# EAGLE board micropet_v2 (EAGLE 6.4), part 1 of 3
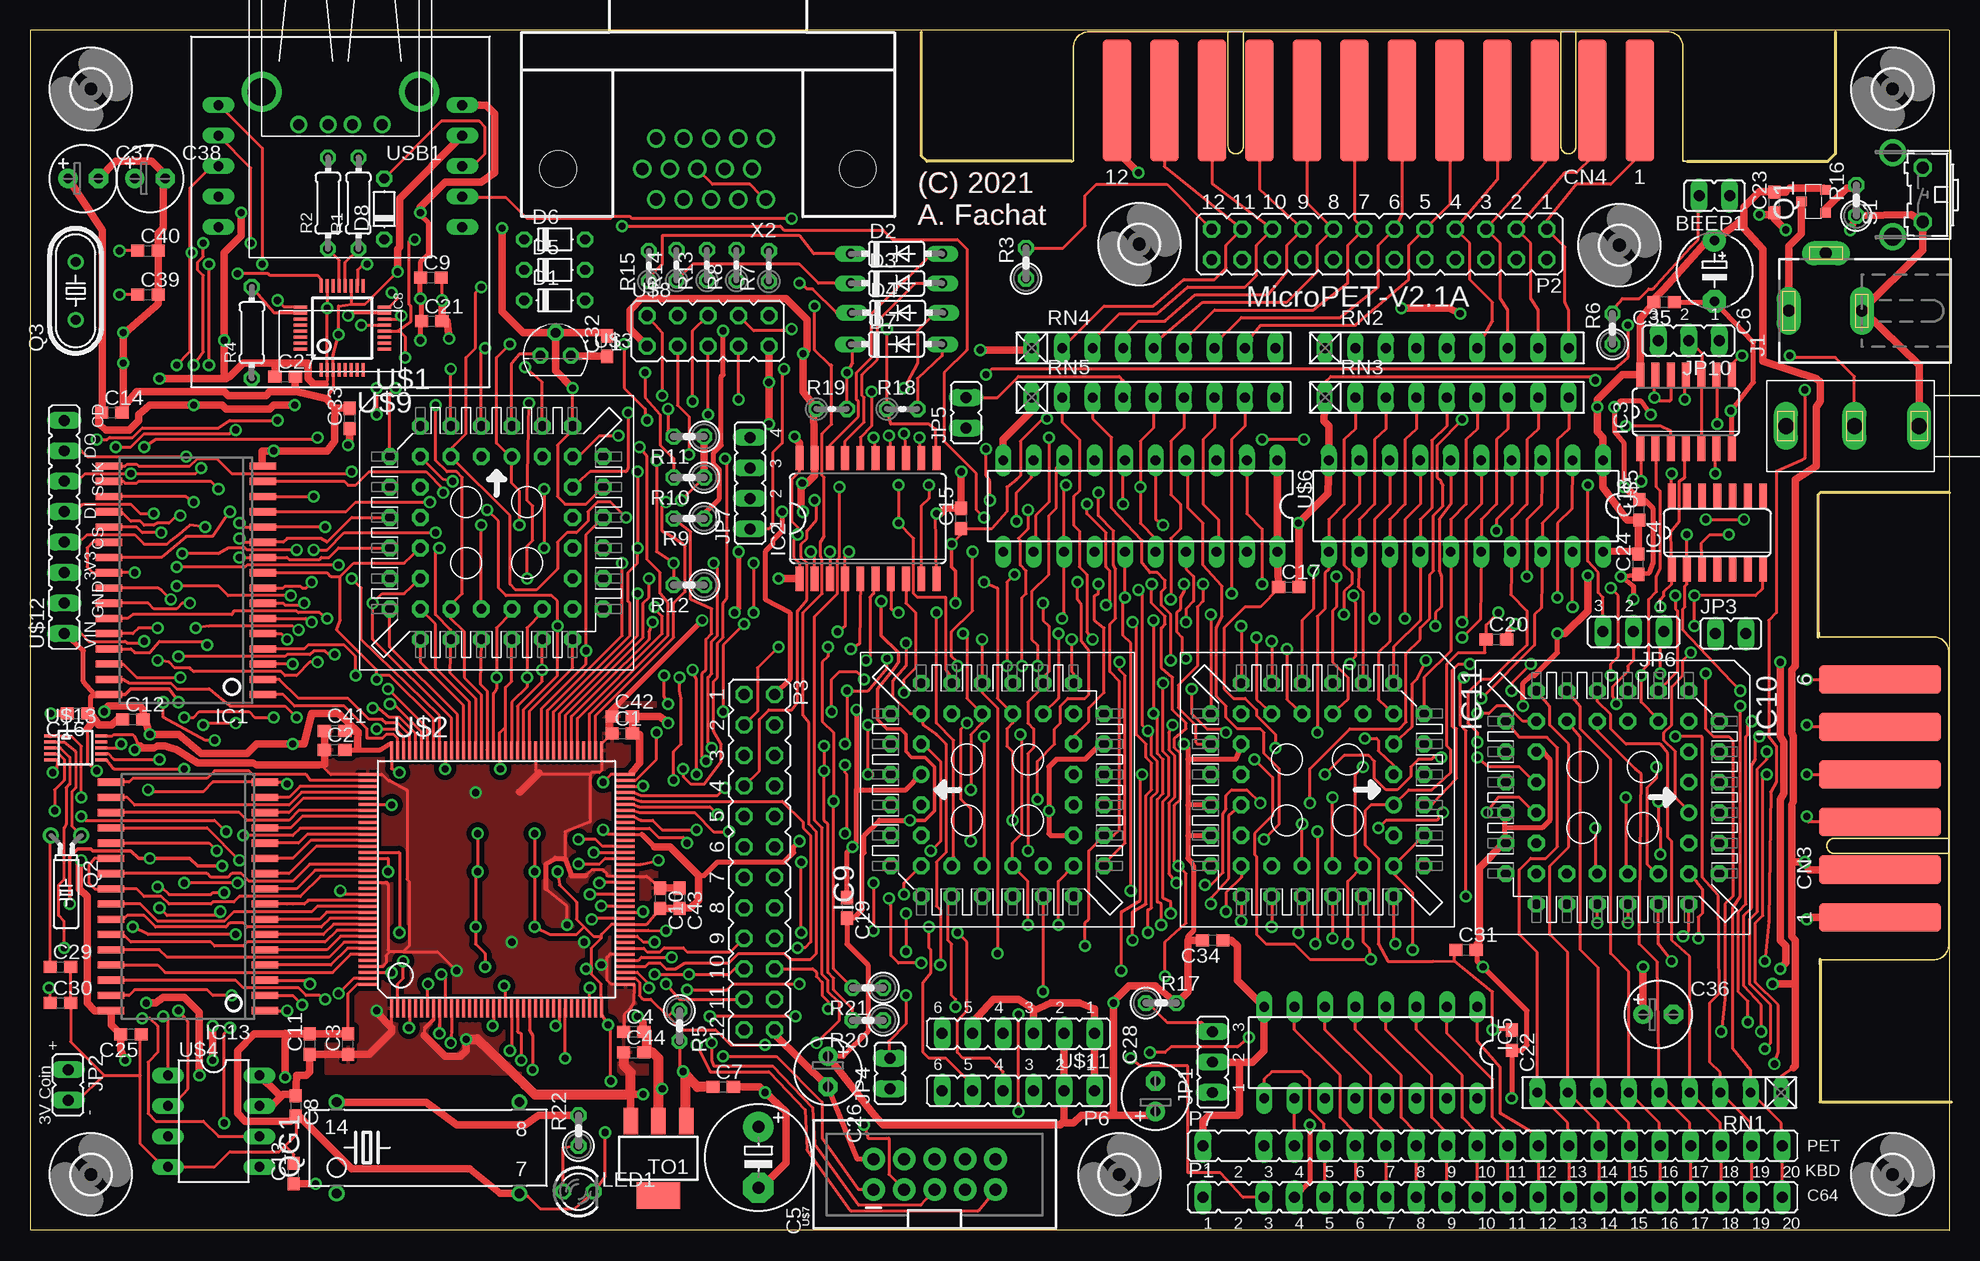
[diagram p6: board, top side]
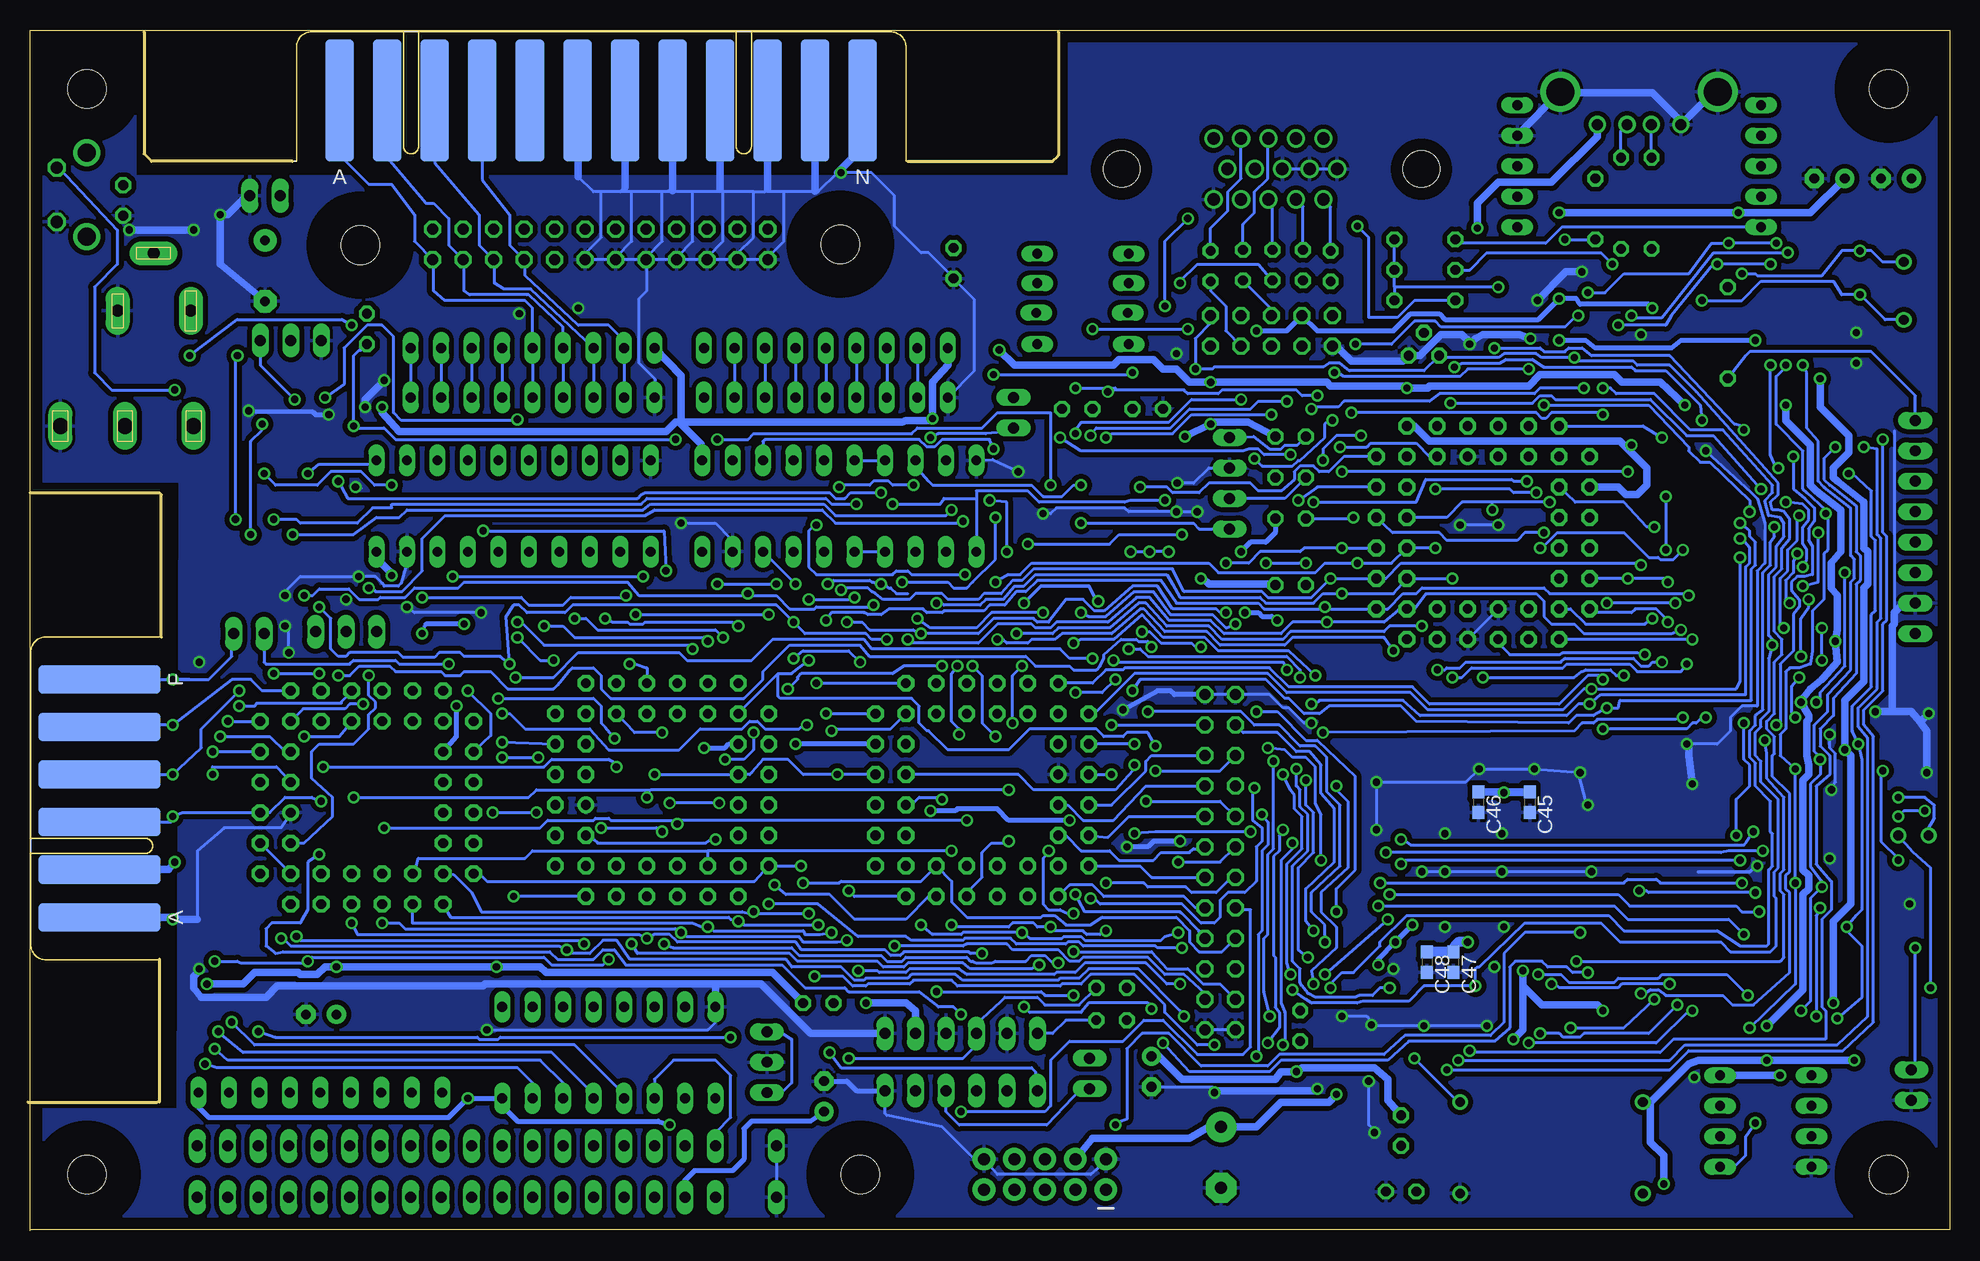
[diagram p7: board, bottom side, seen from below]

Size 160 x 100.09 mm. Coordinates in mm from the lower left corner, seen from the top.
Outline: 160,0.09 0,0.09 0,100.09 75,100.09 159.94,100.09
Outline: 160,0 160,100.09
Copper layers (1*16): Top 0.035mm / dielectric 1.5mm / Bottom 0.035mm
Design rules "default *": minimum track width 8mil, minimum drill 0.3mm, track to track 6mil, track to pad 6mil, pad to pad 6mil, via to via 6mil, smd to smd 6mil, copper to edge 40mil, drill to drill 8mil, minimum pad ring 10mil, minimum via ring 8mil, stop-mask expansion 4mil, vias tented up to drill 0mil, thermal gap 10mil
Milling: 11 lines

## Footprints (pad centres in the part's own frame; a part is rotated, then mirrored left to right if it is on the bottom)
JP2 = drill 0.914 long: 1 0,-1.27; 2 0,1.27
C0603 = smd 1.1 x 1: 1 -0.85,0; 2 0.85,0
E5-8,5 = drill 1.016 pad 2.54: + -2.54,0 | drill 1.016 pad 2.54 octagon: - 2.54,0
E5-6 = drill 0.813 pad 1.905: + -2.54,0 | drill 0.813 pad 1.905 octagon: - 2.54,0
E2,5-6 = drill 0.813 pad 1.6: + -1.27,0 | drill 0.813 pad 1.6 octagon: - 1.27,0
MA156_6-2_KEYED = smd 2.388 x 10.16: 1 -9.906,0; 2 -5.944,0; 3 -1.981,0; 4 1.981,0; 5 5.944,0; 6 9.906,0 | smd 2.388 x 10.16 bottom: A -9.906,0; B -5.944,0; C -1.981,0; D 1.981,0; E 5.944,0; F 9.906,0
MA156_12-2_IEEE = smd 2.388 x 10.16: 1 -21.793,0; 2 -17.831,0; 3 -13.868,0; 4 -9.906,0; 5 -5.944,0; 6 -1.981,0; 7 1.981,0; 8 5.944,0; 9 9.906,0; 10 13.868,0; 11 17.831,0; 12 21.793,0 | smd 2.388 x 10.16 bottom: A -21.793,0; B -17.831,0; C -13.868,0; D -9.906,0; E -5.944,0; F -1.981,0; H 1.981,0; J 5.944,0; K 9.906,0; L 13.868,0; M 17.831,0; N 21.793,0
D-5 = drill 0.813 octagon: A 2.54,0; C -2.54,0
DO35-7 = drill 0.813 long: A 3.81,0; C -3.81,0
3,2 = hole 3.2: 0,0
SOP32 = smd 0.6 x 2.2: 1 -8.89,-6.416; 2 -7.62,-6.416; 3 -6.35,-6.416; 4 -5.08,-6.416; 5 -3.81,-6.416; 6 -2.54,-6.416; 7 -1.27,-6.416; 8 0,-6.416; 9 1.27,-6.416; 10 2.54,-6.416; 11 3.81,-6.416; 12 5.08,-6.416; 13 6.35,-6.416; 14 7.62,-6.416; 15 8.89,-6.416; 16 10.16,-6.416; 17 10.16,6.416; 18 8.89,6.416; 19 7.62,6.416; 20 6.35,6.416; 21 5.08,6.416; 22 3.81,6.416; 23 2.54,6.416; 24 1.27,6.416; 25 0,6.416; 26 -1.27,6.416; 27 -2.54,6.416; 28 -3.81,6.416; 29 -5.08,6.416; 30 -6.35,6.416; 31 -7.62,6.416; 32 -8.89,6.416
SO20W = smd 0.66 x 2.032: 1 -5.715,-5.029; 2 -4.445,-5.029; 3 -3.175,-5.029; 4 -1.905,-5.029; 5 -0.635,-5.029; 6 0.635,-5.029; 7 1.905,-5.029; 8 3.175,-5.029; 9 4.445,-5.029; 10 5.715,-5.029; 11 5.715,5.029; 12 4.445,5.029; 13 3.175,5.029; 14 1.905,5.029; 15 0.635,5.029; 16 -0.635,5.029; 17 -1.905,5.029; 18 -3.175,5.029; 19 -4.445,5.029; 20 -5.715,5.029
SO14 = smd 0.66 x 2.032: 1 -3.81,-3.073; 2 -2.54,-3.073; 3 -1.27,-3.073; 4 0,-3.073; 5 1.27,-3.073; 6 2.54,-3.073; 7 3.81,-3.073; 8 3.81,3.073; 9 2.54,3.073; 10 1.27,3.073; 11 0,3.073; 12 -1.27,3.073; 13 -2.54,3.073; 14 -3.81,3.073
DIL16 = drill 0.813 long: 1 -8.89,-3.81; 2 -6.35,-3.81; 3 -3.81,-3.81; 4 -1.27,-3.81; 5 1.27,-3.81; 6 3.81,-3.81; 7 6.35,-3.81; 8 8.89,-3.81; 9 8.89,3.81; 10 6.35,3.81; 11 3.81,3.81; 12 1.27,3.81; 13 -1.27,3.81; 14 -3.81,3.81; 15 -6.35,3.81; 16 -8.89,3.81
TQFP32-5MM = smd 1.143 x 0.254: 1 -3.5,1.75; 2 -3.5,1.25; 3 -3.5,0.75; 4 -3.5,0.25; 5 -3.5,-0.25; 6 -3.5,-0.75; 7 -3.5,-1.25; 8 -3.5,-1.75; 17 3.5,-1.75; 18 3.5,-1.25; 19 3.5,-0.75; 20 3.5,-0.25; 21 3.5,0.25; 22 3.5,0.75; 23 3.5,1.25; 24 3.5,1.75 | smd 0.254 x 1.143: 9 -1.75,-3.5; 10 -1.25,-3.5; 11 -0.75,-3.5; 12 -0.25,-3.5; 13 0.25,-3.5; 14 0.75,-3.5; 15 1.25,-3.5; 16 1.75,-3.5; 25 1.75,3.5; 26 1.25,3.5; 27 0.75,3.5; 28 0.25,3.5; 29 -0.25,3.5; 30 -0.75,3.5; 31 -1.25,3.5; 32 -1.75,3.5
PLCC44 = drill 0.813 pad 1.397: 1 1.27,6.35 | drill 0.813 pad 1.397 octagon: 2 -1.27,8.89; 3 -1.27,6.35; 4 -3.81,8.89; 5 -3.81,6.35; 6 -6.35,8.89; 7 -8.89,6.35; 8 -6.35,6.35; 9 -8.89,3.81; 10 -6.35,3.81; 11 -8.89,1.27; 12 -6.35,1.27; 13 -8.89,-1.27; 14 -6.35,-1.27; 15 -8.89,-3.81; 16 -6.35,-3.81; 17 -8.89,-6.35; 18 -6.35,-8.89; 19 -6.35,-6.35; 20 -3.81,-8.89; 21 -3.81,-6.35; 22 -1.27,-8.89; 23 -1.27,-6.35; 24 1.27,-8.89; 25 1.27,-6.35; 26 3.81,-8.89; 27 3.81,-6.35; 28 6.35,-8.89; 29 8.89,-6.35; 30 6.35,-6.35; 31 8.89,-3.81; 32 6.35,-3.81; 33 8.89,-1.27; 34 6.35,-1.27; 35 8.89,1.27; 36 6.35,1.27; 37 8.89,3.81; 38 6.35,3.81; 39 8.89,6.35; 40 6.35,8.89; 41 6.35,6.35; 42 3.81,8.89; 43 3.81,6.35; 44 1.27,8.89
DCJ0202 = drill 1 pad 2 long: 1 0,3.1; 2 4.8,0; 3 0,-3
JP2' = drill 0.914 long: 1 -2.54,0; 2 0,0; 3 2.54,0
JP1 = drill 0.914 long: 1 0,-1.27; 2 0,1.27
JP4 = drill 0.914 long: 1 -3.81,0; 2 -1.27,0; 3 1.27,0; 4 3.81,0
LED3MM = drill 0.813 octagon: A -1.27,0; K 1.27,0
C64KEYB = drill 0.914 long: 1 0,0; 3 5.08,0; 4 7.62,0; 5 10.16,0; 6 12.7,0; 7 15.24,0; 8 17.78,0; 9 20.32,0; 10 22.86,0; 11 25.4,0; 12 27.94,0; 13 30.48,0; 14 33.02,0; 15 35.56,0; 16 38.1,0; 17 40.64,0; 18 43.18,0; 19 45.72,0; 20 48.26,0
FLAT24 = drill 0.914 octagon: 1 -13.97,-1.27; 2 -11.43,-1.27; 3 -8.89,-1.27; 4 -6.35,-1.27; 5 -3.81,-1.27; 6 -1.27,-1.27; 7 1.27,-1.27; 8 3.81,-1.27; 9 6.35,-1.27; 10 8.89,-1.27; 11 11.43,-1.27; 12 13.97,-1.27; A -13.97,1.27; B -11.43,1.27; C -8.89,1.27; D -6.35,1.27; E -3.81,1.27; F -1.27,1.27; H 1.27,1.27; J 3.81,1.27; K 6.35,1.27; L 8.89,1.27; M 11.43,1.27; N 13.97,1.27
JP6 = drill 0.914 long: 1 -7.62,1.27; 2 -5.08,1.27; 3 -2.54,1.27; 4 0,1.27; 5 2.54,1.27; 6 5.08,1.27
MICRO3 = smd 0.8 x 0.9: 1 -0.95,-1; 2 0.95,-1; 3 0,1
TC26H = drill 0.813: 1 -1.27,0; 2 1.27,0
HC49/S = drill 0.813: 1 -2.413,0; 2 2.413,0
SG51 = drill 0.813: 1 -7.62,-3.81; 7 7.62,-3.81; 8 7.62,3.81; 14 -7.62,3.81
0204/7 = drill 0.813 octagon: 1 -3.81,0; 2 3.81,0
0207/2V = drill 0.813 octagon: 1 -1.27,0; 2 1.27,0
0204V = drill 0.813 octagon: 1 -1.27,0; 2 1.27,0
RN-9 = drill 0.813 long: 1 -10.16,0; 2 -7.62,0; 3 -5.08,0; 4 -2.54,0; 5 0,0; 6 2.54,0; 7 5.08,0; 8 7.62,0; 9 10.16,0
B3F-31XX = drill 1.016 octagon: 1 -2.261,-1.245; 2 2.261,-1.245 | drill 1.499 pad 2.159: 3 -3.505,1.245; 4 3.505,1.245
SOT223 = smd 1.219 x 2.235: 1 -2.311,-3.099; 2 0,-3.099; 3 2.311,-3.099 | smd 3.6 x 2.2: 4 0,3.099
TQFP144 = smd 0.27 x 1.5: 1 -8.75,-12.02; 2 -8.25,-12.02; 3 -7.75,-12.02; 4 -7.25,-12.02; 5 -6.75,-12.02; 6 -6.25,-12.02; 7 -5.75,-12.02; 8 -5.25,-12.02; 9 -4.75,-12.02; 10 -4.25,-12.02; 11 -3.75,-12.02; 12 -3.25,-12.02; 13 -2.75,-12.02; 14 -2.25,-12.02; 15 -1.75,-12.02; 16 -1.25,-12.02; 17 -0.75,-12.02; 18 -0.25,-12.02; 19 0.25,-12.02; 20 0.75,-12.02; 21 1.25,-12.02; 22 1.75,-12.02; 23 2.25,-12.02; 24 2.75,-12.02; 25 3.25,-12.02; 26 3.75,-12.02; 27 4.25,-12.02; 28 4.75,-12.02; 29 5.25,-12.02; 30 5.75,-12.02; 31 6.25,-12.02; 32 6.75,-12.02; 33 7.25,-12.02; 34 7.75,-12.02; 35 8.25,-12.02; 36 8.75,-12.02; 73 8.75,9.48; 74 8.25,9.48; 75 7.75,9.48; 76 7.25,9.48; 77 6.75,9.48; 78 6.25,9.48; 79 5.75,9.48; 80 5.25,9.48; 81 4.75,9.48; 82 4.25,9.48; 83 3.75,9.48; 84 3.25,9.48; 85 2.75,9.48; 86 2.25,9.48; 87 1.75,9.48; 88 1.25,9.48; 89 0.75,9.48; 90 0.25,9.48; 91 -0.25,9.48; 92 -0.75,9.48; 93 -1.25,9.48; 94 -1.75,9.48; 95 -2.25,9.48; 96 -2.75,9.48; 97 -3.25,9.48; 98 -3.75,9.48; 99 -4.25,9.48; 100 -4.75,9.48; 101 -5.25,9.48; 102 -5.75,9.48; 103 -6.25,9.48; 104 -6.75,9.48; 105 -7.25,9.48; 106 -7.75,9.48; 107 -8.25,9.48; 108 -8.75,9.48 | smd 1.5 x 0.27: 37 10.75,-10.02; 38 10.75,-9.52; 39 10.75,-9.02; 40 10.75,-8.52; 41 10.75,-8.02; 42 10.75,-7.52; 43 10.75,-7.02; 44 10.75,-6.52; 45 10.75,-6.02; 46 10.75,-5.52; 47 10.75,-5.02; 48 10.75,-4.52; 49 10.75,-4.02; 50 10.75,-3.52; 51 10.75,-3.02; 52 10.75,-2.52; 53 10.75,-2.02; 54 10.75,-1.52; 55 10.75,-1.02; 56 10.75,-0.52; 57 10.75,-0.02; 58 10.75,0.48; 59 10.75,0.98; 60 10.75,1.48; 61 10.75,1.98; 62 10.75,2.48; 63 10.75,2.98; 64 10.75,3.48; 65 10.75,3.98; 66 10.75,4.48; 67 10.75,4.98; 68 10.75,5.48; 69 10.75,5.98; 70 10.75,6.48; 71 10.75,6.98; 72 10.75,7.48; 109 -10.75,7.48; 110 -10.75,6.98; 111 -10.75,6.48; 112 -10.75,5.98; 113 -10.75,5.48; 114 -10.75,4.98; 115 -10.75,4.48; 116 -10.75,3.98; 117 -10.75,3.48; 118 -10.75,2.98; 119 -10.75,2.48; 120 -10.75,1.98; 121 -10.75,1.48; 122 -10.75,0.98; 123 -10.75,0.48; 124 -10.75,-0.02; 125 -10.75,-0.52; 126 -10.75,-1.02; 127 -10.75,-1.52; 128 -10.75,-2.02; 129 -10.75,-2.52; 130 -10.75,-3.02; 131 -10.75,-3.52; 132 -10.75,-4.02; 133 -10.75,-4.52; 134 -10.75,-5.02; 135 -10.75,-5.52; 136 -10.75,-6.02; 137 -10.75,-6.52; 138 -10.75,-7.02; 139 -10.75,-7.52; 140 -10.75,-8.02; 141 -10.75,-8.52; 142 -10.75,-9.02; 143 -10.75,-9.52; 144 -10.75,-10.02
TO92 = drill 0.813 octagon: 1 -1.27,1.27; 2 0,3.175; 3 1.27,1.27
DIL08 = drill 0.813 long: 1 -11.43,-2.54; 2 -8.89,-2.54; 3 -6.35,-2.54; 4 -3.81,-2.54; 5 -3.81,5.08; 6 -6.35,5.08; 7 -8.89,5.08; 8 -11.43,5.08
DIL20 = drill 0.813 long: 1 -10.16,-3.81; 2 -7.62,-3.81; 3 -5.08,-3.81; 4 -2.54,-3.81; 5 0,-3.81; 6 2.54,-3.81; 7 5.08,-3.81; 8 7.62,-3.81; 9 10.16,-3.81; 10 12.7,-3.81; 11 12.7,3.81; 12 10.16,3.81; 13 7.62,3.81; 14 5.08,3.81; 15 2.54,3.81; 16 0,3.81; 17 -2.54,3.81; 18 -5.08,3.81; 19 -7.62,3.81; 20 -10.16,3.81
FLAT10BOX = drill 1.016 pad 1.88: 1 -1.27,5.08; 2 1.27,5.08; 3 -1.27,2.54; 4 1.27,2.54; 5 -1.27,0; 6 1.27,0; 7 -1.27,-2.54; 8 1.27,-2.54; 9 -1.27,-5.08; 10 1.27,-5.08
FLAT10RIB = drill 0.914 octagon: 1 -5.08,-1.27; 2 -5.08,1.27; 3 -2.54,-1.27; 4 -2.54,1.27; 5 0,-1.27; 6 0,1.27; 7 2.54,-1.27; 8 2.54,1.27; 9 5.08,-1.27; 10 5.08,1.27
ETHOLIENC = drill 0.813 long: 1_1 15.24,10.16; 1_2 12.7,10.16; 1_3 10.16,10.16; 1_4 7.62,10.16; 1_5 5.08,10.16; 2_1 5.08,-10.16; 2_2 7.62,-10.16; 2_3 10.16,-10.16; 2_4 12.7,-10.16; 2_5 15.24,-10.16
CUI_MJ-3502-B = drill 1.3 pad 2 long: 1 -5.084,0; 2 0.313,0; 3 6.028,0
GRAVITECH-SDCARD = drill 0.914 long: 3V3 -3.81,0; CD 8.89,0; CS -1.27,0; DI 1.27,0; DO 6.35,0; GND -6.35,0; SCK 3.81,0; VIN -8.89,0
MSOP10 = smd 0.25 x 1: 1 -1,-2.113; 2 -0.5,-2.113; 3 0,-2.113; 4 0.5,-2.113; 5 1,-2.113; 6 1,2.113; 7 0.5,2.113; 8 0,2.113; 9 -0.5,2.113; 10 -1,2.113
USB-A-H = drill 0.914: D+ 2.718,-1.003; D- 2.718,1.003; GND 2.718,-3.493; VBUS 2.718,3.493 | drill 2.311: GND@1 0,6.566; GND@2 0,-6.566
HDR15RA = drill 1.016: 1 4.318,2.54; 2 2.032,2.54; 3 -0.254,2.54; 4 -2.54,2.54; 5 -4.826,2.54; 6 5.461,0; 7 3.175,0; 8 0.889,0; 9 -1.397,0; 10 -3.683,0; 11 4.318,-2.54; 12 2.032,-2.54; 13 -0.254,-2.54; 14 -2.54,-2.54; 15 -4.826,-2.54 | hole 3.048: -12.497,0; 12.497,0

## Placement (x,y rotation side)
BEEP1  PIEZOBEEPER  [JP2]  140.41,86.28 90 top
C1  0.1u  [C0603]  49.37,41.43 0 top
C2  0.1u  [C0603]  25.39,40.08 0 top
C3  0.1u  [C0603]  26.51,15.56 90 top
C4  0.1u  [C0603]  50.32,16.59 0 top
C5  47u  [E5-8,5]  60.72,6.11 270 top
C6  47u  [E5-6]  140.41,80.01 270 top
C7  100n  [C0603]  57.78,11.99 0 top
C8  100n  [C0603]  22.14,10.4 270 top
C9  1.0u Cer  [C0603]  33.41,79.45 0 top
C10  1u  [C0603]  52.54,27.7 270 top
C11  1u  [C0603]  23.33,15.56 90 top
C12  0.1u  [C0603]  8.57,42.62 0 top
C13  0.1u  [C0603]  21.98,4.76 90 top
C14  0.1u  [C0603]  6.82,68.18 0 top
C15  0.1u  [C0603]  77.62,59.37 90 top
C16  0.1u  [C0603]  3.96,43.1 180 top
C17  0.1u  [C0603]  104.93,53.66 0 top
C18  0.1u  [C0603]  134.14,60.09 90 top
C19  0.1u  [C0603]  68.1,26.91 270 top
C20  0.1u  [C0603]  122.23,49.29 0 top
C21  0.1u  [C0603]  33.49,75.8 0 top
C22  0.1u  [C0603]  123.5,15.88 270 top
C23  0.1u  [C0603]  145.41,85.73 90 top
C24  0.1u  [C0603]  134.06,55.56 90 top
C25  0.1u  [C0603]  8.41,16.35 180 top
C26  47u  [E2,5-6]  66.51,13.26 270 top
C27  0.1u  [C0603]  21.27,71.2 0 top
C28  22u  [E2,5-6]  93.82,11.19 90 top
C29  18p  [C0603]  2.54,21.99 0 top
C30  18p  [C0603]  2.54,18.97 0 top
C31  0.1u  [C0603]  119.69,23.42 0 top
C32  0.1u  [C0603]  48.1,73.74 90 top
C33  0.1u  [C0603]  26.66,67.71 90 top
C34  0.1u  [C0603]  98.58,24.21 180 top
C35  0.1u  [C0603]  136.2,77.39 180 top
C36  22u  [E2,5-6]  135.73,18.02 0 top
C37  22u  [E2,5-6]  4.44,87.71 0 top
C38  22u  [E2,5-6]  10,87.71 0 top
C39  18p  [C0603]  9.84,78.03 0 top
C40  18p  [C0603]  9.84,81.68 0 top
C41  0.1u  [C0603]  25.39,41.67 0 top
C42  0.1u  [C0603]  49.37,42.86 0 top
C43  0.1u  [C0603]  54.13,27.7 270 top
C44  0.1u  [C0603]  50.32,14.84 0 top
C45  0.1u  [C0603]  35,35.72 270 bottom
C46  0.1u  [C0603]  39.29,35.72 270 bottom
C47  0.1u  [C0603]  41.35,22.38 270 bottom
C48  0.1u  [C0603]  43.57,22.38 270 bottom
CN3  PORT_CASSETTE_EDGE  [MA156_6-2_KEYED]  154.22,36.04 90 top
CN4  PORT_IEEE_EDGE  [MA156_12-2_IEEE]  112.39,94.22 180 top
D1  1N4148  [D-5]  43.73,77.55 0 top
D2  1N4148DO35-7  [DO35-7]  72.23,81.44 0 top
D3  1N4148DO35-7  [DO35-7]  72.23,78.98 0 top
D4  1N4148DO35-7  [DO35-7]  72.31,76.52 0 top
D5  1N4148  [D-5]  43.73,80.09 0 top
D6  1N4148  [D-5]  43.73,82.63 0 top
D7  1N4148DO35-7  [DO35-7]  72.23,73.9 0 top
D8  1N4148  [D-5]  29.52,85.17 90 top
H1  MOUNT-HOLE3.2  [3,2]  5.08,4.68 0 top
H2  MOUNT-HOLE3.2  [3,2]  5.08,95.17 0 top
H3  MOUNT-HOLE3.2  [3,2]  155.25,95.17 0 top
H4  MOUNT-HOLE3.2  [3,2]  155.25,4.68 0 top
H5  MOUNT-HOLE3.2  [3,2]  92.47,82.23 0 top
H6  MOUNT-HOLE3.2  [3,2]  132.47,82.15 0 top
H7  MOUNT-HOLE3.2  [3,2]  90.8,4.68 0 top
IC1  RAMSOCK32TO512KSOP  [SOP32]  13.01,53.58 90 top
IC2  74LS245DW  [SO20W]  69.84,59.37 0 top
IC3  74HCT00D  [SO14]  138.03,68.26 0 top
IC4  74LS86D  [SO14]  140.65,58.18 0 top
IC5  74LS145N  [DIL16]  111.75,14.84 180 top
IC8  MAX3421E  [TQFP32-5MM]  26.03,75.25 90 top
IC9  VIAPLCC  [PLCC44]  80.64,36.75 90 top
IC10  PIAPLCC  [PLCC44]  131.92,36.12 270 top
IC11  PIAPLCC  [PLCC44]  107.31,36.75 270 top
IC13  RAMSOCK32TO512KSOP  [SOP32]  13.17,27.23 90 top
J1  DCJ0202  [DCJ0202]  149.7,76.68 90 top
JP1  [JP2']  98.58,14.05 90 top
JP2  [JP1]  3.17,12.14 180 top
JP3  [JP1]  141.76,49.77 270 top
JP4  [JP1]  71.67,13.1 0 top
JP5  [JP1]  78.02,68.18 0 top
JP6  [JP2']  133.66,49.93 180 top
JP7  [JP4]  60,62.31 90 top
JP10  [JP2']  138.27,74.22 180 top
LED1  [LED3MM]  45.72,3.25 0 top
P1  C64KEYB  [C64KEYB]  97.78,2.78 0 top
P2  IEEE488FLATCABLE  [FLAT24]  112.47,82.23 180 top
P3  PETUSERPORT  [FLAT24]  60.8,30.72 270 top
P6  CBMTAPE  [JP6]  81.12,12.94 180 top
P7  PETKEYBD  [C64KEYB]  97.78,7.06 0 top
Q1  IRLML5203  [MICRO3]  148.66,85.8 90 top
Q2  32kHz  [TC26H]  3.01,32.94 180 top
Q3  12MHz  [HC49/S]  3.8,78.34 90 top
QG1  50MHz  [SG51]  33.17,6.91 0 top
R1  33  [0204/7]  27.38,85.65 90 top
R2  33  [0204/7]  24.84,85.65 90 top
R3  2k4  [0207/2V]  83.02,80.65 90 top
R4  33  [0204/7]  18.49,74.85 90 top
R5  1k  [0207/2V]  54.13,17.07 270 top
R6  10  [0207/2V]  131.92,75.17 90 top
R7  68  [0204V]  61.59,80.41 90 top
R8  68  [0204V]  58.89,80.49 90 top
R9  10k  [0207/2V]  54.92,59.37 180 top
R10  10k  [0207/2V]  54.92,62.79 180 top
R11  10k  [0207/2V]  54.92,66.2 180 top
R12  1k  [0207/2V]  54.92,53.82 180 top
R13  390  [0204V]  56.43,80.49 90 top
R14  390  [0204V]  53.89,80.49 90 top
R15  390  [0204V]  51.59,80.41 90 top
R16  100k  [0207/2V]  152.24,85.88 90 top
R17  390  [0207/2V]  94.29,18.97 0 top
R18  2320  [0204V]  72.7,68.5 0 top
R19  680  [0204V]  66.83,68.5 0 top
R20  10  [0207/2V]  69.84,17.54 180 top
R21  10  [0207/2V]  69.84,20.24 180 top
R22  390  [0207/2V]  45.72,8.33 90 top
RN1  10k  [RN-9]  135.81,11.51 180 top
RN2  2k4  [RN-9]  118.1,73.58 0 top
RN3  5k1  [RN-9]  118.1,69.45 0 top
RN4  2k4  [RN-9]  93.66,73.58 0 top
RN5  5k1  [RN-9]  93.66,69.45 0 top
S1  [B3F-31XX]  156.52,86.36 90 top
TO1  LM2937SOT-3.3V  [SOT223]  52.38,6.03 180 top
U$1  W65C816SPLCC  [PLCC44]  38.89,58.18 0 top
U$2  XC95288XLTQ144  [TQFP144]  38.89,30.56 0 top
U$3  DS1813  [TO92]  43.81,71.68 0 top
U$4  SPIFLASH  [DIL08]  14.04,1.51 270 top
U$5  74LS641  [DIL20]  120.96,60.4 180 top
U$6  74LS641  [DIL20]  93.82,60.4 180 top
U$7  XILINXPROG  [FLAT10BOX]  75.4,4.68 90 top
U$8  MONOVIDAUDIO  [FLAT10RIB]  56.51,75.01 0 top
U$9  ETHOLIENC  [ETHOLIENC]  25.87,78.58 90 top
U$10  MONOAUDIOB  [CUI_MJ-3502-B]  152.39,67.07 180 top
U$11  PETSKEY_EXTRA  [JP6]  81.12,17.7 180 top
U$12  SD-CARD-GRAVI  [GRAVITECH-SDCARD]  2.85,58.66 90 top
U$13  MCP79510  [MSOP10]  3.8,40.24 270 top
USB1  USB-A-H  [USB-A-H]  25.87,94.93 270 top
X2  D-SUB15-HDR15RA  [HDR15RA]  56.51,88.5 180 top

## Tracks (layer width: path | path; a pad name or v marks a point on that pad's centre or on a via)
12MHZ  (via drill 0.6)
  Top 0.254: IC8.24 24.28,79.3 23.97,79.61 20,79.61 19.84,79.77 v17.3,79.77 | C40.1 v7.46,81.68
  Bottom 0.254: v17.3,79.77 16.19,79.77 16.03,79.61 10.63,79.61 C40.1 v7.46,81.68 6.5,81.68 5.58,80.76 Q3.2
50M  (via drill 0.6)
  Top 0.254: v44.6,14.37 44.6,18.5 U$2.30
  Bottom 0.254: v44.6,14.37 41.05,10.81 40.86,10.81 40.86,10.78 QG1.8
/C1MTR  (via drill 0.6)
  Top 0.254: v125.09,47.23 123.5,45.64 v123.5,45.01
  Bottom 0.254: JP3.1 140.49,47.39 140.33,47.23 133.34,47.23 133.03,47.55 129.53,47.55 129.22,47.23 v125.09,47.23 | v123.5,45.01 121.6,43.1 121.6,41.27 IC10.20
/C2MTR  (via drill 0.6)
  Top 0.254: IC9.15 v84.45,19.92 | v73.02,19.61 73.02,17.22 71.59,15.8 71.59,14.45 JP4.2 | IC3.12 136.76,69.21 136.68,69.14 135.57,69.14 135.41,69.29 | 135.41,69.29 v135.41,69.45 | v135.41,69.45 135.41,71.26 IC3.13 | v97.94,28.81 98.42,28.81 99.45,29.84 99.45,34.77 99.69,35.16 99.69,36.27 100.17,36.75 101.44,36.75 v102.55,35.64 | v106.67,35.64 106.67,38.5 110.01,41.83 114.14,41.83 114.69,42.39 114.69,48.1 115.88,49.29 115.88,50.24 116.68,51.04 116.68,54.69 116.99,55.01 116.99,59.61 117.79,60.4 117.79,62.15 117.63,62.31 117.63,62.47 117.31,62.79 117.31,65.48 v119.38,67.63 | v135.41,69.45 135.73,69.45 135.41,69.29
  Bottom 0.254: v84.45,19.92 75.72,19.92 75.4,19.61 v73.02,19.61 | IC9.15 85.08,27.86 86.99,25.96 91.28,25.96 93.34,28.02 96.99,28.02 v97.94,28.81 | v102.55,35.64 v106.67,35.64 | v119.38,67.63 119.69,67.63 119.77,67.55 129.06,67.55 129.69,68.18 129.69,74.53 130.65,75.49 131.92,75.49 133.82,73.58 133.82,70.56 v135.41,69.45
/FRAMSEL  (via drill 0.6)
  Top 0.254: IC1.22 5.23,57.39 4.76,56.91 4.76,55.32 5.23,54.85 IC1.24 v8.73,54.85 | U$2.2 30.63,20.56 30.95,20.87 30.96,20.87 31.11,21.03 v31.11,22.46 | v15.39,40.88 14.6,40.88 11.11,42.78 v11.11,44.05
  Bottom 0.254: v31.11,22.46 14.12,22.46 13.81,22.78 13.81,28.02 14.12,28.34 14.12,29.77 13.81,30.08 13.81,36.12 15.24,37.7 15.24,39.77 v15.39,40.88 | v11.11,44.05 10.79,44.37 10.79,44.85 8.73,47.07 v8.73,54.85
/IRQ  (via drill 0.6)
  Top 0.254: IC10.41 138.9,29.13 | 138.9,29.13 139.38,28.5 139.38,26.43 139.06,26.11 v139.06,24.37 | IC11.42 IC11.41 113.66,29.77 115.25,28.18 v115.25,23.42 | 138.9,29.13 138.11,29.84 | v63.81,17.86 v56.67,17.86 | v56.35,39.13 56.03,39.45 56.03,46.43 56.35,46.75 56.35,49.29 56.83,49.77 56.83,51.83 55.08,52.63 55.08,58.26 R9.2 | v37.62,78.66 37.14,78.18 37.14,73.58 36.35,72.79 36.35,66.44 35.08,65.17 U$1.5 40,59.61 40,53.9 40.48,53.42 42.22,53.42 43.97,55.17 43.97,57.39 44.76,58.18 45.56,58.18 46.51,59.13 46.51,59.93 47.3,60.72 48.41,60.72 v49.68,59.45
  Bottom 0.254: v139.06,24.37 138.9,24.37 138.27,23.73 115.88,23.73 v115.25,23.42 115.25,23.1 113.34,23.1 112.23,24.21 111.12,24.21 110.01,22.62 96.99,22.62 96.52,21.99 92.39,21.99 91.28,20.88 90.48,20.88 90.32,21.03 86.83,21.03 86.51,21.35 82.86,21.35 82.23,20.88 74.29,20.88 74.13,21.03 72.54,21.03 71.75,21.83 67.62,21.83 64.13,18.34 v63.81,17.86 | IC10.42 IC10.41 | v56.67,17.86 56.67,18.02 57.15,19.92 57.15,24.37 56.83,24.69 56.83,31.35 56.35,31.83 v56.35,39.13 | D6.A D5.A 46.27,78.66 | 46.27,78.66 D1.A | v37.62,78.66 46.27,78.66 | R9.2 49.76,59.37 v49.68,59.45
/NMI  (via drill 0.6)
  Top 0.254: U$1.7 30,69.77 v30.47,70.25 | v53.18,68.5 53.18,66.67 R11.2
  Bottom 0.254: JP7.4 58.02,66.2 56.67,65.17 55.72,65.17 55.4,65.48 54.37,65.48 R11.2 | v30.47,70.25 34.13,70.25 34.6,69.77 42.54,69.77 43.33,69.14 50.48,69.14 50.95,68.66 53.02,68.66 v53.18,68.5
/RAMCS
  Top 0.254: IC13.22 5.39,31.04 4.92,30.4 4.92,28.97 5.39,28.5 IC13.24 6.91,28.65 7.3,28.65 7.46,28.5 8.89,28.5 9.52,27.86 10.95,27.86 11.58,27.23 15.08,27.23 15.24,27.38 16.98,27.38 17.46,27.86 22.54,27.86 24.22,29.54 U$2.126
/RAMWE
  Top 0.254: IC13.29 10.63,22.15 11.27,21.51 25.24,21.51 26.72,23.04 U$2.139
/RES  (via drill 0.6)
  Top 0.254: IC11.37 111.12,24.05 111.6,23.57 v111.75,22.62 106.67,22.62 105.41,23.89 103.02,23.89 102.23,24.69 102.23,31.19 102.07,31.35 102.07,33.1 103.58,34.61 103.58,37.78 v102.07,39.29 | v147.95,70.09 147.95,64.37 147.63,64.21 145.57,63.26 145.57,51.51 144.93,50.88 144.93,41.2 145.57,40.4 145.57,37.39 145.09,36.59 144.93,25.8 v144.62,22.46 | v72.38,62.15 v72.38,58.98 73.66,57.71 73.66,53.1 73.97,52.78 76.35,52.78 76.35,46.75 76.83,46.12 IC9.37 | U$6.8 85.56,63.58 85.56,60.25 84.93,59.61 84.93,54.69 83.5,53.26 83.5,49.29 83.97,48.82 v83.97,47.07 | U$1.44 40.16,72.31 40.79,73.1 42.46,73.1 U$3.1 | v62.86,71.83 62.86,71.68 62.7,71.52 62.7,65.64 61.91,64.85 61.91,58.82 61.59,58.5 JP7.1 | U$2.143 26.99,21.04 v25.71,19.76 | IC8.12 30.63,75 | 30.63,75 30.8,75 31.27,74.53 v31.27,72.79 | 30.63,75 31.74,75.79 31.74,77.07 31.59,77.23 31.59,82.47 v32.06,82.63 | v96.83,45.16 96.83,43.1 98.1,41.83 99.37,41.83 v99.69,41.51 | v136.84,22.46 135.73,23.89 IC10.37
  Bottom 0.254: v111.75,22.62 112.23,22.15 116.52,22.15 117.15,22.78 136.52,22.78 v136.84,22.46 137.16,22.46 137.31,22.3 142.39,22.3 142.71,22.46 v144.62,22.46 | S1.2 157.59,88.62 152.71,83.42 152.71,80.57 154.62,78.66 154.62,71.52 153.19,70.09 v147.95,70.09 | U$6.8 86.2,63.74 85.08,62.47 84.77,62.15 76.51,62.15 75.56,61.2 73.97,61.2 73.02,62.15 v72.38,62.15 | v72.38,58.98 63.02,58.98 62.54,58.5 JP7.1 | v25.71,19.76 25.39,19.76 24.92,20.08 24.28,20.08 23.65,19.61 18.89,19.61 18.09,18.81 16.35,18.81 13.33,21.51 13.33,28.18 13.65,28.5 13.65,29.61 13.33,29.92 13.33,36.43 14.76,37.86 14.76,39.61 14.6,39.77 14.6,41.2 15.24,41.83 15.24,42.47 14.6,43.1 14.6,47.39 13.97,48.02 13.97,49.29 14.6,49.93 14.6,54.53 13.97,55.17 13.97,56.91 13.33,57.71 13.33,59.29 13.81,59.93 14.28,60.09 14.76,60.09 14.92,60.72 14.28,61.36 14.28,62.31 21.11,69.93 23.33,72.15 26.03,72.15 26.35,72.47 30.95,72.47 v31.27,72.79 33.97,72.79 34.44,73.1 37.14,73.1 37.62,72.79 42.38,72.79 U$3.1 43.81,71.68 50,71.68 50.8,72.31 51.75,72.31 52.22,71.99 61.27,71.99 61.43,71.83 v62.86,71.83 62.86,74.37 61.59,75.64 U$8.10 | v83.97,47.07 87.15,47.07 88.1,46.43 95.72,46.43 96.04,46.12 96.04,45.96 v96.83,45.16 | v99.69,41.51 99.69,40.08 100.48,39.29 v102.07,39.29 | v32.06,82.63 D8.C
/SEL1  (via drill 0.6)
  Top 0.254: IC10.25 125.41,34.85 124.14,36.12 122.39,36.12 v121.44,34.85 | v117.79,34.85 117.31,34.21 113.02,34.21 v112.39,33.58 | U$2.69 50.37,36.54 50.95,36.27 57.3,36.27 v57.94,36.91 | v107.31,33.26 107.31,24.21 v107.15,23.89 | v74.29,22.3 72.38,22.3 71.75,22.94 71.75,27.07 v71.59,27.7
  Bottom 0.254: v121.44,34.85 v117.79,34.85 | v112.39,33.58 107.79,33.58 v107.31,33.26 | v57.94,36.91 58.1,36.59 58.1,34.21 57.3,33.58 57.3,32.46 57.78,31.99 57.78,29.13 58.73,28.18 60.16,28.18 60.8,27.54 60.8,26.11 61.27,25.64 62.38,25.64 63.97,27.23 70.8,27.23 71.11,27.54 v71.59,27.7 | v107.15,23.89 106.36,23.57 96.52,23.57 95.88,22.94 89.05,22.94 88.58,22.46 87.31,22.46 86.99,22.78 81.91,22.78 81.59,22.46 81.43,22.46 81.12,22.3 79.85,22.3 79.53,22.46 76.99,22.46 76.51,22.94 75.4,22.94 74.77,22.3 v74.29,22.3
/SEL2  (via drill 0.6)
  Top 0.254: U$2.68 50.24,36.04 50.95,35.8 62.7,35.8 64.45,34.05 64.45,33.58 65.08,32.94 65.08,24.05 64.61,23.57 v63.97,23.57 | v98.42,27.23 98.42,27.7 99.93,29.37 99.93,34.61 IC11.25
  Bottom 0.254: v63.97,23.57 66.03,23.57 66.19,23.73 72.23,23.73 72.54,24.05 73.5,24.05 73.66,23.89 77.78,23.89 78.26,24.37 82.07,24.37 82.23,24.21 86.51,24.21 86.99,24.53 90.96,24.53 94.29,27.23 v98.42,27.23
/SEL4  (via drill 0.6)
  Top 0.254: U$2.66 50.28,35.04 50.8,34.85 55.4,34.85 56.99,33.26 v58.26,33.26 | v67.94,33.1 67.94,33.26 68.1,33.42 68.1,38.02 67.94,38.18 v67.94,38.81
  Bottom 0.254: v58.26,33.26 66.19,33.26 v67.94,33.1 | v67.94,38.81 68.1,38.34 69.53,36.75 76.35,36.75 77.62,38.02 IC9.25
/SRQIN  (via drill 0.6)
  Top 0.254: CN4.10 98.52,87.29 P2.10 102.23,82.15 102.23,79.61 101.28,78.66 96.52,78.66 93.97,76.44 90.8,76.44 88.58,74.22 RN4.3 | RN5.3 88.58,67.71 90.16,66.12 90.16,60.25 92.7,57.55 92.7,55.64 93.34,54.85 93.97,54.85 94.61,54.21 94.61,53.58 94.29,53.26 94.29,52.15 95.09,51.36 v95.09,47.55 | R20.2 68.57,18.49 66.99,20.08 66.99,21.03 66.51,21.51 66.51,33.89 66.19,34.21 v66.19,38.34 v66.19,40.4
  Bottom 0.254: RN4.3 RN5.3 | 97.63,46.43 IC11.19 | v66.19,38.34 60.8,38.34 P3.3 | v66.19,40.4 66.83,41.51 68.57,41.51 68.89,41.2 70.48,41.2 71.11,41.83 76.67,41.83 78.42,40.08 83.5,40.08 85.08,41.67 85.24,41.67 85.88,42.31 85.88,43.74 86.51,44.37 97.47,44.37 97.63,44.53 97.63,46.43 | 97.63,46.43 96.52,46.43 v95.09,47.55
/USBINT  (via drill 0.6)
  Top 0.254: v28.09,80.57 27.78,80.57 27.3,80.09 27.3,78.77 IC8.18
  Bottom 0.254: D5.C 40,80.09 38.57,81.52 29.05,81.52 v28.09,80.57
A0  (via drill 0.6)
  Top 0.254: IC11.39 113.66,24.21 v113.82,23.89 | U$2.104 32.14,41.44 30.79,42.78 30,42.78 29.13,43.49 29.12,43.49 v28.57,43.58 | v24.6,58.66 IC1.12 17.93,58.66 17.62,58.98 v17.46,58.98 | v67.94,40.56 67.94,40.72 68.1,40.88 v68.1,45.01 69.84,45.01 71.43,46.91 v71.43,47.7 | v119.69,27.86 119.69,41.67 119.22,42.15 119.22,45.8 v119.53,46.12 | v137.79,24.53 138.27,25 IC10.39
  Bottom 0.254: v137.79,24.53 137.47,24.21 113.98,24.21 113.82,24.05 v113.82,23.89 | v24.6,58.66 25.24,58.66 27.14,60.72 31.19,60.72 U$1.10 | v17.46,58.98 16.82,58.5 16.66,58.34 16.66,57.86 16.19,57.39 16.19,55.48 16.5,55.17 16.5,44.21 27.46,44.21 27.62,43.58 v28.57,43.58 29.68,42.94 31.11,42.94 31.74,42.31 44.45,42.47 45.72,43.74 51.75,43.74 52.54,43.1 53.81,43.1 55.08,44.37 55.4,44.37 56.99,45.96 67.46,45.96 v68.1,45.01 | v67.94,40.56 IC9.42 | v71.43,47.7 73.34,47.7 74.13,48.5 89.85,48.5 90.48,49.29 98.1,49.29 99.85,47.55 105.25,47.55 105.88,48.18 114.3,48.18 116.36,46.12 v119.53,46.12 | IC11.39 v119.69,27.86
A1  (via drill 0.6)
  Top 0.254: v111.12,38.66 110.48,38.02 110.48,31.19 110.64,31.04 IC11.38 109.85,29.13 v109.85,23.89 | v135.57,38.66 135.57,37.7 134.77,36.91 134.77,30.56 135.25,30.08 135.57,29.84 IC10.38 | U$2.103 32.64,41.57 30.32,43.89 v30,43.89 | U$1.11 26.82,59.45 24.76,57.39 24.28,57.71 21.43,57.71 21.11,57.39 IC1.11 17.77,57.39 v17.46,57.71 | v53.18,43.89 52.86,44.53 v52.86,46.28 | v73.02,48.97 73.02,47.07 71.91,45.8 71.91,44.53 73.34,43.1 IC9.41 74.45,42.15 75.56,41.35 76.35,40.56 76.35,31.51 75.56,30.72 75.56,27.07 75.88,26.75 v75.88,22.15
  Bottom 0.254: v135.57,38.66 117.15,38.66 116.52,39.29 111.75,39.29 111.28,38.97 v111.12,38.66 | v17.46,57.71 17.3,57.71 16.66,56.91 16.66,55.64 16.98,55.32 16.98,44.69 29.05,44.69 v30,43.89 30.95,43.89 31.9,42.94 44.13,42.94 45.56,44.21 52.54,44.21 52.86,43.89 v53.18,43.89 | v52.86,46.28 55.08,48.34 60.96,48.34 62.07,49.45 65.56,49.45 67.3,51.36 69.69,49.29 72.38,49.29 v73.02,48.97 | v75.88,22.15 76.04,22.15 76.51,21.83 81.59,21.83 82.23,22.3 86.83,22.3 87.15,21.99 88.89,21.99 89.37,22.46 96.04,22.46 96.67,23.1 109.37,23.1 v109.85,23.89
A2  (via drill 0.6)
  Top 0.254: U$1.13 25.71,56.91 24.92,56.12 24.28,56.12 24.12,55.96 21.58,55.96 21.43,56.12 IC1.10 v17.46,56.12 | U$2.102 33.14,41.87 v29.84,45.16
  Bottom 0.254: v17.46,56.12 17.46,45.8 17.77,45.16 v29.84,45.16 30.47,45.16 32.22,43.42 43.49,43.42 44.92,44.85 55.24,44.85 56.83,46.43 67.94,46.43 71.27,43.1 IC9.40
A3  (via drill 0.6)
  Top 0.254: IC1.9 24.76,54.85 25.08,54.53 25.87,54.53 | 25.87,54.53 26.98,55.64 31.19,55.64 U$1.14 | U$2.101 33.64,42.64 30,46.28 29.2,46.28 v28.89,45.96 28.89,46.75 25.55,50.09 25.87,50.88 25.87,54.53
  Bottom 0.254: v28.89,45.96 29.2,46.28 30.16,46.28 32.54,43.89 43.33,43.89 44.76,45.32 55.08,45.32 56.67,46.91 68.73,46.91 68.89,46.75 70.32,46.75 71.43,45.64 IC9.39
A4  (via drill 0.6)
  Top 0.254: IC1.8 21.11,53.58 21.27,53.74 22.54,53.74 22.7,53.58 23.01,53.58 v23.49,54.05 | U$2.100 34.14,42.93 27.62,49.29 27.62,53.58 v26.82,54.37
  Bottom 0.254: v23.49,54.05 23.81,54.37 v26.82,54.37 U$1.15
A5  (via drill 0.6)
  Top 0.254: IC1.7 21.11,52.31 21.27,52.15 22.54,52.15 v22.86,52.31 | U$1.16 31.19,53.1 29.36,53.1 v28.57,52.31 28.57,49.29 35.14,42.72 U$2.98
  Bottom 0.254: v22.86,52.31 v28.57,52.31
A6  (via drill 0.6)
  Top 0.254: IC1.6 23.01,51.04 23.33,50.72 v23.49,50.72 | U$2.97 35.64,43.02 30,48.66 U$1.17
  Bottom 0.254: v23.49,50.72 23.65,51.04 24.44,51.83 26.19,51.83 26.51,51.51 29.68,51.51 U$1.17
A7  (via drill 0.6)
  Top 0.254: IC1.5 20.95,49.77 v21.43,49.29 | U$1.18 32.54,47.39 36.14,43.79 U$2.96
  Bottom 0.254: v21.43,49.29 U$1.18
A8  (via drill 0.6)
  Top 0.254: v24.76,51.04 24.12,51.51 22.38,51.51 22.22,51.67 16.98,51.67 16.82,51.36 8.57,51.36 8.09,51.04 IC1.27 | U$2.95 36.64,44.08 33.81,46.91 33.81,50.56 U$1.19
  Bottom 0.254: U$1.19 31.59,51.83 30.32,50.56 25.39,50.56 v24.76,51.04
A9  (via drill 0.6)
  Top 0.254: U$2.94 37.14,44.37 35,46.51 U$1.20 35.08,50.09 33.81,51.36 33.81,56.59 v34.13,56.91 | v22.22,56.75 18.09,56.75 17.93,56.91 16.5,56.91 15.71,56.44 v12.7,56.44 | v13.33,52.31 12.7,52.31 12.22,51.83 10.31,51.83 9.84,52.31 IC1.26
  Bottom 0.254: v34.13,56.91 33.81,57.07 32.7,58.18 27.14,58.18 25.08,56.12 24.28,56.12 24.12,55.96 23.01,55.96 v22.22,56.75 | v12.7,56.44 13.01,55.8 13.01,54.85 13.65,54.21 13.65,52.63 v13.33,52.31
A10  (via drill 0.6)
  Top 0.254: U$2.93 37.62,40.06 37.62,44.69 36.19,46.12 36.19,49.93 35,51.12 U$1.21 35.08,52.15 36.03,53.1 36.03,62.79 35.55,63.26 34.76,63.26 33.81,64.21 v33.81,68.82 | v16.66,59.93 15.24,57.86 13.01,57.86 10.95,56.12 IC1.23
  Bottom 0.254: v33.81,68.82 25.08,68.82 21.74,65.33 21.74,65.01 20.79,64.06 20,64.06 16.66,60.88 v16.66,59.93
A11  (via drill 0.6)
  Top 0.254: U$1.22 37.54,45.56 38.1,45.01 38.1,40.08 U$2.92 | v25.39,48.02 24.92,48.02 24.6,48.34 23.65,48.34 23.33,48.02 21.43,48.02 21.27,47.86 v12.38,47.86 | v11.74,52.63 10.95,53.42 10.63,53.58 IC1.25
  Bottom 0.254: U$1.22 37.62,48.97 36.67,48.02 32.54,48.02 32.22,48.18 26.03,48.18 v25.39,48.02 | v12.38,47.86 12.38,51.04 11.74,51.99 v11.74,52.63
A12  (via drill 0.6)
  Top 0.254: U$1.25 40.08,51.43 38.89,50.24 v38.89,46.12 38.89,45.16 38.64,44.78 U$2.91 | v27.14,46.28 27.14,47.86 26.19,48.82 23.17,48.82 22.86,48.5 IC1.4
  Bottom 0.254: v38.89,46.12 31.27,46.12 30.63,46.59 30.32,46.75 28.25,46.75 27.78,46.28 v27.14,46.28
A13  (via drill 0.6)
  Top 0.254: U$2.87 40.64,43.74 42.7,45.8 v42.7,46.75 U$1.26 | v23.97,47.39 23.33,47.39 22.22,46.28 21.27,46.28 20.95,46.59 13.65,46.59 13.33,46.91 12.06,46.91 11.58,47.39 v10.63,47.55 | v10.63,50.24 9.04,50.24 8.57,49.77 IC1.28
  Bottom 0.254: v42.7,46.75 42.06,46.75 41.91,46.91 40.79,46.91 40.32,47.39 32.38,47.39 32.06,47.7 26.35,47.7 25.71,47.07 25.08,47.07 24.76,47.39 v23.97,47.39 | v10.63,47.55 v10.63,50.24
A14  (via drill 0.6)
  Top 0.254: U$1.27 42.62,51.43 41.43,50.24 v41.43,46.12 41.43,45.32 40.16,44.05 40.16,40.06 U$2.88 | v21.9,47.23 IC1.3
  Bottom 0.254: v41.43,46.12 40.64,46.12 39.84,46.91 32.22,46.91 31.9,47.23 26.66,47.23 26.03,46.59 22.38,46.59 v21.9,47.23
A15
  Top 0.254: U$2.85 41.64,43.31 45.24,46.91 U$1.28
ABORTB  (via drill 0.6)
  Top 0.254: U$1.4 v35.08,71.83 | v51.27,71.52 51.27,69.45 52.54,68.02 52.54,65.48 53.65,64.37 R10.2
  Bottom 0.254: v35.08,71.83 40.16,71.83 40.79,71.2 50.48,71.2 51.27,71.68 v51.27,71.52 | R10.2 55.4,61.04 JP7.2
ATN  (via drill 0.6)
  Top 0.254: CN4.11 94.56,88.71 P2.11 99.69,82.15 99.69,80.25 98.74,79.3 96.2,79.3 93.66,77.07 89.53,77.07 RN4.2 | IC11.44 116.91,35.56 118.9,37.7 118.9,41.83 118.58,41.99 118.58,46.75 119.06,47.23 v120.01,47.23 | v135.88,51.99 135.88,52.63 136.2,52.94 136.2,53.26 136.84,53.9 IC4.1 136.76,58.26 137.47,59.13 137.47,62.47 137.95,62.79 137.95,65.11 IC3.4 | 96.36,56.67 U$6.17 96.36,55.17 96.99,54.53 96.99,52.47 96.36,51.83 v96.36,50.72 | RN5.2 86.04,67.39 87.47,65.96 87.47,61.67 86.99,61.2 86.99,58.82 87.47,58.34 87.47,55.32 88.1,54.69 88.1,49.93 88.42,49.45 v88.58,49.29
  Bottom 0.254: RN4.2 RN5.2 | v135.88,51.99 134.93,51.04 134.93,48.5 134.3,47.86 133.66,47.86 133.34,48.18 129.3,48.18 128.9,47.78 126.28,47.78 125.88,48.18 124.14,48.18 123.82,47.86 120.8,47.86 v120.01,47.23 120.33,51.2 119.69,52.15 119.22,52.15 118.58,51.51 115.41,51.51 114.77,52.15 97.78,52.15 v96.36,50.72 95.4,49.77 90.32,49.77 89.85,49.29 v88.58,49.29
ATNA_EN
  Top 0.254: JP10.2 139.38,73.1 139.38,71.42 IC3.10 IC3.5
ATNOUT  (via drill 0.6)
  Top 0.254: v78.42,32.46 78.42,35.16 77.62,35.96 77.62,41.83 v78.1,42.31 | v77.31,47.07 77.31,47.39 76.83,47.86 76.83,49.93 78.58,51.67 v78.58,56.59 | v80,60.88 80,62.47 79.69,62.94 v79.69,65.17
  Bottom 0.254: IC9.13 81.91,28.18 80.64,29.45 80.64,31.51 79.85,32.31 78.58,32.31 v78.42,32.46 | v78.1,42.31 78.1,46.28 v77.31,47.07 | v78.58,56.59 78.58,60.72 v80,60.88 | v79.69,65.17 80,65.96 83.97,65.96 84.61,65.33 85.24,65.33 85.88,65.96 98.74,65.96 98.9,65.8 U$6.3
C1MTR  (via drill 0.6)
  Top 0.254: v148.11,45.96 154.2,45.96 CN3.6
  Bottom 0.254: CN3.6 146.7,45.94 v148.11,45.96 145.09,45.96 143.19,47.86 143.19,49.53 JP3.2
C1RD  (via drill 0.6)
  Top 0.254: CN3.3 148.26,34.05 v148.11,34.53 | v135.73,35.8 135.73,33.73 135.88,33.58 v135.88,31.35 | v82.39,9.92 v82.39,18.02
  Bottom 0.254: CN3.3 148.26,34.05 v148.11,34.53 147.31,34.85 IC10.44 140.01,34.85 138.74,36.12 136.52,36.12 v135.73,35.8 | v135.88,31.35 136.84,30.72 136.84,26.75 137.31,25.96 137.47,25.64 139.85,25.64 140.33,25.16 140.33,23.73 139.54,23.1 138.9,23.26 116.68,23.26 116.04,22.62 113.02,22.62 112.23,23.42 111.28,23.42 110.33,22.15 97.31,22.15 95.4,20.24 92.07,20.24 91.75,19.92 85.88,19.92 84.29,18.65 83.02,18.65 v82.39,18.02 | P3.8 59.37,26.75 58.26,26.75 58.26,15.32 58.89,14.68 62.7,14.68 65.56,17.54 67.15,17.54 68.89,15.8 73.34,15.8 74.92,14.21 74.92,10.4 75.4,9.92 v82.39,9.92
C1SW  (via drill 0.6)
  Top 0.254: CN3.5 148.12,41.98 v148.11,42.15
  Bottom 0.254: CN3.5 154.05,42.15 v148.11,42.15 143.19,45.96 141.6,45.96 140.65,45.01 IC10.7
C2MTR
  Bottom 0.254: JP4.1 72.38,11.83 75.24,8.81 82.55,8.81 83.66,9.92 P6.3
C2RD  (via drill 0.6)
  Top 0.254: P6.4 81.12,13.26 80,14.37 77.78,14.37 77.31,14.84 77.31,17.54 78.1,18.34 78.1,24.05 v77.31,24.84 | v85.72,25.48 85.72,29.13 IC9.19 | v64.29,24.84 v64.29,30.72
  Bottom 0.254: v85.72,25.48 84.77,24.69 82.39,24.69 82.23,24.84 v77.31,24.84 77.15,24.84 76.67,24.37 73.97,24.37 73.81,24.53 72.38,24.53 72.07,24.21 65.72,24.21 65.4,24.53 v64.29,24.84 | v64.29,30.72 60.8,30.72 P3.6
C2SW  (via drill 0.6)
  Top 0.254: v140.97,16.59 141.28,19.29 141.28,27.23 141.92,27.86 141.92,40.88 141.6,41.2 140.33,41.2 139.69,41.83 v139.69,46.43 | v101.59,16.11 100.64,15.32 95.09,15.32 94.61,14.84 v93.34,14.84 | v135.88,46.43 135.88,49.61 JP6.1
  Bottom 0.254: v140.97,16.59 140.81,16.59 139.54,16.11 122.71,16.11 122.55,15.95 120.96,15.95 120.8,16.11 v101.59,16.11 | v93.34,14.84 92.39,13.57 76.51,13.57 76.19,13.26 76.19,11.91 P6.6 | v139.69,46.43 v135.88,46.43
C2SW/ATNIN  (via drill 0.6)
  Top 0.254: JP6.2 133.66,47.55 133.19,47.07 133.19,46.59 131.92,45.32 131.92,44.53 v132.23,43.89
  Bottom 0.254: v132.23,43.89 133.34,43.89 133.74,43.5 137.23,43.5 IC10.8
CWR  (via drill 0.6)
  Top 0.254: v148.11,38.02 CN3.4 | v142.55,45.01 137.79,50.09 137.79,51.83 137.95,51.99 137.95,53.74 138.11,53.9 138.11,55.03 IC4.2 v138.11,58.02 | v83.18,60.09 83.18,58.5 82.39,57.71 82.55,57.55 82.55,55.48 83.02,55.01 83.02,53.1 82.7,52.78 v82.7,47.07 | P6.5 78.58,12.14 76.35,14.37 74.92,14.37 74.45,14.84 74.45,20.72 75.08,21.51 75.08,23.42 74.92,23.57 v74.92,25.32 | v82.55,41.35 82.7,41.2 82.7,33.1 81.91,32.31 IC9.14 83.18,29.13 v83.18,25.48 | v70.32,28.97 v70.32,25
  Bottom 0.254: CN3.4 147.95,38.02 v148.11,38.02 145.73,40.24 145.73,41.83 v142.55,45.01 | v138.11,58.02 133.03,58.02 131.12,59.45 129.22,59.45 128.58,60.09 108.9,60.09 108.26,60.56 93.82,60.56 92.86,59.61 83.66,59.61 v83.18,60.09 | v82.55,41.35 82.55,41.83 83.18,42.47 83.18,46.43 v82.7,47.07 | v83.18,25.48 83.02,25.32 78.42,25.32 78.1,25.64 76.35,25.64 76.04,25.32 v74.92,25.32 74.61,25 72.23,25 71.91,24.69 70.8,24.69 70.48,25 v70.32,25 | P3.7 59.84,29.45 61.11,28.18 63.18,28.18 63.65,28.65 66.83,28.65 67.15,28.97 v70.32,28.97
D0  (via drill 0.6)
  Top 0.254: IC11.36 v108.58,36.12 | v133.03,36.12 133.03,29.84 IC10.36 | IC1.13 26.35,59.93 27.14,60.72 v33.33,60.72 | U$2.86 41.14,43.45 43.97,46.28 v43.97,50.4 43.97,52.47 43.49,52.94 39.68,52.94 39.05,53.58 39.05,59.13 v38.1,60.09 | v77.78,49.77 78.1,49.45 78.1,44.37 IC9.36 79.37,42.31 78.42,41.35 v78.42,36.75
  Bottom 0.254: v133.03,36.12 118.42,36.12 117.79,36.75 108.26,36.75 | v108.58,36.12 108.58,36.43 108.26,36.75 | v33.33,60.72 38.1,60.72 | 38.1,60.72 40.64,60.72 41.91,59.45 U$1.36 | v43.97,50.4 46.67,50.4 47.14,49.93 54.92,49.93 55.56,49.29 60.64,49.29 61.75,50.4 65.24,50.4 66.99,52.31 67.62,52.31 70,50.24 74.29,50.24 74.77,49.77 v77.78,49.77 | v78.42,36.75 108.26,36.75 | v38.1,60.09 38.1,60.72
D1  (via drill 0.6)
  Top 0.254: IC11.35 v108.58,24.37 | IC1.14 v23.65,61.2 | v23.65,56.75 24.76,56.75 26.19,58.18 v33.81,58.18 | U$2.83 42.64,43.52 46.35,47.23 v46.35,48.34 46.35,58.02 U$1.35 | v79.37,49.29 IC9.35 79.37,44.85 80.64,43.58 v80.64,23.1 | IC10.35 v133.19,25.64
  Bottom 0.254: v133.19,25.64 132.71,24.69 109.21,24.69 v108.58,24.37 107.94,24.69 106.67,24.69 106.04,24.05 96.2,24.05 95.72,23.42 88.74,23.42 88.26,22.94 87.47,22.94 87.15,23.26 81.75,23.26 81.59,23.1 v80.64,23.1 | v23.65,61.2 v23.65,56.75 | v33.81,58.18 35.4,58.18 36.03,57.55 41.91,57.55 42.54,58.18 46.43,58.18 U$1.35 | v46.35,48.34 47.14,49.45 54.76,49.45 55.4,48.82 60.8,48.82 61.91,49.93 65.4,49.93 67.15,51.83 67.46,51.83 69.84,49.77 73.97,49.77 74.61,49.29 76.51,49.29 76.83,48.97 78.58,48.97 78.89,49.29 v79.37,49.29
D2  (via drill 0.6)
  Top 0.254: IC11.34 v106.04,33.89 | v130.49,33.58 130.49,30.16 IC10.34 | IC1.15 26.19,62.47 26.51,62.15 27.14,62.15 28.25,63.26 33.02,63.26 34.44,61.83 v34.44,61.52 | v42.86,61.83 v42.86,56.91 | U$2.82 43.14,43.38 49.37,49.61 v49.37,55.64 | v79.53,54.05 80.64,53.58 80.64,44.37 IC9.34 81.91,42.31 81.43,41.83 81.43,40.4 81.91,39.93 v81.91,34.21
  Bottom 0.254: v130.49,33.58 117.47,33.58 116.83,34.21 113.02,34.21 112.87,34.37 111.75,34.37 111.6,34.21 105.72,34.21 | v106.04,33.89 105.72,34.21 | v34.44,61.52 36.35,61.52 36.67,61.83 v42.86,61.83 | v42.86,56.91 U$1.34 46.51,55.64 v49.37,55.64 52.07,55.64 52.86,54.85 60.96,54.85 61.75,55.64 76.51,55.64 77.46,54.69 78.42,54.69 v79.53,54.05 | v81.91,34.21 105.72,34.21
D3  (via drill 0.6)
  Top 0.254: IC11.33 106.04,25.32 v105.72,24.84 | IC1.17 7.93,63.74 8.09,63.9 8.89,63.9 9.04,63.74 13.33,63.74 13.97,64.37 15.55,64.37 16.82,63.1 26.66,63.1 v26.82,63.26 | v50.64,63.26 v50.64,56.91 50.64,55.64 49.84,54.85 49.84,52.47 50,52.31 50,49.61 43.64,43.25 U$2.81 | v91.91,24.21 91.91,26.59 93.02,27.23 93.02,36.27 93.5,36.75 93.5,38.97 93.02,39.45 93.02,40.56 92.23,41.35 92.23,50.4 v91.91,50.72 | v60.32,55.64 v60.32,51.51 | v85.72,49.77 85.72,44.37 IC9.32 | v130.65,25.64 IC10.33
  Bottom 0.254: v130.65,25.64 129.22,25.64 128.74,25.16 106.2,25.16 v105.72,24.84 105.56,24.69 105.25,24.53 95.88,24.53 95.56,24.05 92.7,24.05 v91.91,24.21 | v26.82,63.26 v50.64,63.26 | U$1.33 v50.64,56.91 53.81,56.91 54.13,56.59 57.46,56.59 58.41,55.64 v60.32,55.64 60.48,55.64 | v60.32,51.51 60.8,51.51 61.11,51.83 64.77,51.83 66.03,53.74 68.1,53.74 70.48,51.67 71.27,51.67 72.23,52.63 73.66,52.63 75.08,50.72 76.04,50.72 76.35,51.04 79.69,51.04 80.96,49.77 v85.72,49.77 86.35,50.09 90.01,50.09 90.64,50.72 v91.91,50.72
D4  (via drill 0.6)
  Top 0.254: IC1.18 7.77,62.47 7.93,62.31 8.89,62.31 9.04,62.47 15.08,62.47 v15.71,61.83 | U$2.80 44.14,43.11 50.64,49.61 v50.64,53.1 | v41.43,54.37 41.43,57.07 41.91,57.55 41.91,60.4 41.43,60.88 v41.59,68.98 | v84.45,52.31 84.45,50.88 84.93,50.4 84.93,46.59 84.45,46.12 IC9.31 84.45,45.32 83.18,44.05 83.18,42.31 83.66,41.83 83.66,40.24 83.18,39.77 v83.18,31.67
  Bottom 0.254: IC10.32 127.87,30.16 127.63,31.04 118.74,31.04 118.1,31.67 103.5,31.67 | IC11.32 103.5,31.67 | v41.43,54.37 U$1.32 46.35,53.1 v50.64,53.1 52.22,53.1 53.02,52.31 56.99,52.31 57.46,52.78 64.13,52.78 64.77,53.9 65.24,54.69 76.19,54.69 77.15,53.74 77.94,53.74 78.89,52.63 80.32,52.63 80.8,52.15 83.81,52.15 84.13,52.31 v84.45,52.31 | v41.59,68.98 34.76,68.98 34.13,69.61 33.17,69.61 32.86,69.29 24.92,69.29 21.9,66.28 19.68,66.28 v15.71,61.83 | v83.18,31.67 103.5,31.67
D5  (via drill 0.6)
  Top 0.254: IC11.31 v103.5,25.32 | U$2.79 44.64,42.98 51.11,49.45 51.11,52.31 51.59,52.78 v51.59,54.37 | v25.71,55.48 18.09,55.48 17.93,55.32 v12.22,55.32 | v13.65,60.72 13.01,61.2 IC1.19 | v93.18,24.84 93.18,26.75 93.5,26.91 93.5,36.12 93.97,36.59 93.97,39.13 93.5,39.61 93.5,41.35 v93.18,41.67 92.7,42.15 92.7,53.1 v92.39,53.42
  Bottom 0.254: v25.71,55.48 25.87,55.64 45.72,55.64 46.98,54.37 U$1.31 v51.59,54.37 53.18,52.78 56.83,52.78 57.3,53.26 63.81,53.26 64.77,55.17 76.35,55.17 77.31,54.21 78.1,54.21 79.05,53.1 80.48,53.1 80.96,52.63 83.5,52.63 83.97,53.1 86.2,53.1 86.67,52.63 88.89,52.63 89.53,53.1 89.85,53.26 90.16,53.58 91.91,53.58 v92.39,53.42 | v12.22,55.32 12.22,55.48 11.9,55.96 11.9,56.75 12.22,57.23 12.22,58.66 11.74,59.29 11.74,60.09 12.22,60.56 v13.65,60.72 | v93.18,24.84 94.13,24.69 95.4,24.69 95.56,25 103.02,25 103.34,25.32 v103.5,25.32 103.98,25.32 104.77,25.64 128.11,25.64 IC10.31 | v93.18,41.67 93.02,41.83 88.26,41.83 IC9.30
D6  (via drill 0.6)
  Top 0.254: IC11.30 100.96,29.45 99.69,28.18 v99.69,26.59 | v51.91,50.72 51.59,49.93 51.59,49.29 47.62,45.32 45.14,42.88 U$2.78 | v22.38,50.09 22.22,50.09 21.9,50.4 14.92,50.4 v13.81,50.24 | v12.54,59.61 12.22,59.61 11.58,58.98 10.63,58.98 10.31,58.82 9.52,58.82 9.2,59.13 8.41,59.13 7.62,59.93 IC1.20 | v95.09,26.43 95.09,27.38 94.45,27.7 94.45,35.8 94.93,36.27 94.93,39.45 94.45,39.93 v94.45,45.64 | v86.83,49.29 86.83,46.59 86.99,46.43 IC9.29
  Bottom 0.254: IC10.30 124.69,29.69 123.19,28.18 122.39,26.59 100.64,26.59 100.01,26.43 99.69,26.43 | v99.69,26.59 99.69,26.43 | v22.38,50.09 23.17,49.77 30.47,49.77 31.27,50.56 33.17,50.56 33.81,51.2 33.81,52.47 34.44,53.1 43.65,53.1 44.6,51.83 U$1.30 45.95,51.75 47.14,50.72 v51.91,50.72 54.76,50.72 55.72,49.77 60.48,49.77 61.59,50.88 65.08,50.88 66.67,52.78 67.78,52.78 70.16,50.72 74.45,50.72 74.92,50.24 76.19,50.24 76.51,50.56 79.37,50.56 80.96,48.97 86.67,48.97 86.83,49.13 v86.83,49.29 | v13.81,50.24 14.12,50.56 14.12,54.37 13.49,55.01 13.49,56.75 12.7,57.55 12.7,59.45 v12.54,59.61 | 99.69,26.43 v95.09,26.43 | v94.45,45.64 IC9.29
D7  (via drill 0.6)
  Top 0.254: IC11.29 v100.96,25.8 | U$2.77 45.64,42.71 52.7,49.77 52.7,51.2 52.22,51.67 v52.07,51.99 | v21.74,52.94 16.5,52.94 15.71,53.74 v12.22,53.74 | v10.95,58.18 9.36,58.18 8.89,58.66 IC1.21 | v94.29,25.48 94.29,27.23 93.97,27.38 93.97,35.96 94.45,36.43 94.45,39.29 93.97,39.77 93.97,42.78 v93.66,43.1 v93.66,50.88
  Bottom 0.254: IC10.29 125.17,26.51 124.93,26.11 101.75,26.11 101.59,25.96 v100.96,25.8 100.8,25.8 100.48,25.48 v94.29,25.48 | v21.74,52.94 22.06,53.1 33.33,53.1 33.81,53.58 43.97,53.58 44.45,53.1 45.56,53.1 46.83,51.83 U$1.29 51.75,51.83 51.91,51.99 v52.07,51.99 52.22,51.83 57.15,51.83 57.62,52.31 64.45,52.31 65.72,54.21 76.04,54.21 76.99,53.26 77.78,53.26 78.73,52.15 80,52.15 80.48,51.67 83.81,51.67 83.97,51.51 85.24,51.51 85.56,51.83 88.42,51.83 89.05,51.36 90.16,51.36 90.48,51.51 93.18,51.51 v93.66,50.88 | v12.22,53.74 10.95,54.05 v10.95,58.18 | v93.66,43.1 IC9.28
DAV  (via drill 0.6)
  Top 0.254: CN4.6 114.37,84.77 P2.6 112.39,82.15 112.39,78.66 109.21,76.12 100.96,76.12 98.74,73.9 RN4.7 | RN5.7 98.74,66.91 97.78,65.96 97.78,60.56 99.05,59.29 99.05,56.75 U$6.18 | IC9.18 89.53,30.56 91.28,32.31 91.28,46.28 90.8,46.75 v90.8,47.39 | v96.2,53.9 96.2,53.26 95.88,52.78 95.88,51.83 95.56,51.51 95.56,49.93 96.04,49.45 96.04,47.86 v96.36,47.7
  Bottom 0.254: RN4.7 RN5.7 | U$6.18 v96.2,53.9 | v96.36,47.7 95.56,48.34 91.75,48.34 v90.8,47.39
DAVOUT  (via drill 0.6)
  Top 0.254: U$6.2 101.44,59.77 102.71,58.5 v102.71,53.9 | v97.78,53.9 97.78,52.47 97.31,51.99 97.31,47.07 95.72,45.48 95.72,43.58 97.15,42.15 97.15,40.72 97.31,40.56 IC11.20
  Bottom 0.254: v102.71,53.9 v97.78,53.9
DCLK  (via drill 0.6)
  Top 0.254: U$2.45 50.62,24.54 51.11,24.05 v52.07,24.05 | 72.86,54.26 IC2.8 73.02,52.31 73.81,51.51 73.81,46.91 72.86,45.96 v72.86,44.85 | v66.83,43.26 66.83,45.96 67.46,46.59 68.89,46.59 v69.53,45.96
  Bottom 0.254: v52.07,24.05 52.07,25.48 53.18,26.59 53.18,28.18 50.8,30.4 50.8,35.48 51.91,36.59 51.91,39.45 52.86,40.4 54.13,40.4 55.88,42.15 57.94,42.15 59.05,43.26 v66.83,43.26 | v69.53,45.96 70.64,44.85 v72.86,44.85
DEC0
  Top 0.254: P1.12 P7.12 125.65,7.94 122.55,9.76 122.55,13.57 120.64,15.8 IC5.1
DEC1
  Top 0.254: P1.11 P7.11 123.11,8.25 121.91,9.45 121.91,12.62 118.1,16.43 IC5.2
DEC2
  Top 0.254: P1.10 P7.10 120.57,8.25 119.38,9.45 119.38,12.94 115.56,16.75 IC5.3
DEC3
  Top 0.254: IC5.4 113.02,16.75 116.83,12.94 116.83,9.45 118.03,8.25 P7.9 P1.9
DEC4
  Top 0.254: IC5.5 110.48,16.75 114.3,12.94 114.3,9.45 115.49,8.25 P7.8 P1.8
DEC5
  Top 0.254: IC5.6 107.94,16.75 111.75,12.94 111.75,9.45 112.95,8.25 P7.7 P1.7
DEC6
  Top 0.254: IC5.7 105.41,16.75 109.21,12.94 109.21,9.45 110.41,8.25 P7.6 P1.6
DEC7
  Top 0.254: P1.5 P7.5 107.87,8.89 106.67,10.08 106.67,12.62 106.04,13.26 103.5,13.26 102.86,12.62 IC5.9
DEC8
  Top 0.254: P7.4 IC5.10
DEC9
  Bottom 0.254: P7.3 102.79,8.25 101.59,9.45 101.59,12.94 102.86,14.21 106.36,14.21 107.94,12.62 IC5.11
DENA  (via drill 0.6)
  Top 0.254: U$2.41 50.71,22.54 50.95,22.78 v53.49,22.78 | v53.65,37.54 53.65,39.93 54.29,40.56 54.29,44.37 54.13,45.01 v54.13,46.12 | 69.21,54.26 IC2.5 69.13,48.89 v68.42,48.5
  Bottom 0.254: v53.49,22.78 54.29,23.42 54.29,30.24 53.02,31.51 53.02,34.85 53.65,35.48 53.65,37.23 | 53.65,37.23 v53.65,37.54 53.49,37.39 53.65,37.23 | v68.42,48.5 67.46,48.5 66.83,47.86 55.24,47.86 54.13,46.75 v54.13,46.12
DETECT
  Bottom 0.254: U$12.CD 2.85,69.61 6.5,73.26 16.66,73.26 16.98,72.95 R4.1
DIAG  (via drill 0.6)
  Top 0.254: IC10.10 135.65,42.7 134.3,44.05 v134.3,46.28 134.3,46.59 134.93,47.23 134.93,52.63 135.57,53.26 135.57,54.53 135.88,55.17 135.88,61.67 135.57,61.99 135.57,65.11 IC3.2 | v66.51,48.66 66.51,47.86 66.03,47.39 66.03,42.47 66.99,41.51 v66.99,35.8 66.99,21.83 R21.2
  Bottom 0.254: v134.3,46.28 133.34,46.28 132.55,47.07 130.01,47.07 129.53,46.59 125.72,46.59 125.41,46.28 124.14,46.28 123.82,46.59 121.6,46.59 120.17,45.16 116.36,45.16 116.04,45.48 115.09,46.59 114.77,46.91 113.02,46.91 112.39,46.28 112.39,45.16 111.6,44.37 100.48,44.37 98.9,45.96 98.9,46.59 96.67,48.82 90.8,48.82 90.01,47.86 76.99,47.86 76.19,47.07 73.34,47.07 73.02,46.75 71.11,46.75 70.8,47.07 70.48,47.7 70.48,48.02 69.05,49.29 67.78,49.29 67.62,49.13 66.83,49.13 v66.51,48.66 | P3.5 60.8,35.8 v66.99,35.8
DIO1  (via drill 0.6)
  Top 0.254: RN2.9 128.27,76.76 127.95,77.39 127.95,81.99 P2.1 126.36,83.58 126.36,84.06 128.9,87.23 131.76,87.23 134.18,89.66 CN4.1 | RN3.9 128.27,66.83 127.31,65.96 127.31,60.25 126.04,58.98 U$5.18 125.96,51.91 125.41,51.36 125.41,48.82 v120.96,44.37 | v111.28,41.04 112.23,41.04 112.39,40.88 112.39,40 113.66,38.81 IC11.3
  Bottom 0.254: RN2.9 RN3.9 | v120.96,44.37 113.02,44.37 112.39,43.74 112.39,42.31 112.07,41.99 v111.28,41.04
DIO2  (via drill 0.6)
  Top 0.254: RN2.8 125.72,76.76 125.09,77.71 125.09,82.31 P2.2 127.95,88.19 128.9,88.19 130.22,89.51 CN4.2 | RN3.8 125.72,66.83 124.77,65.96 124.77,60.56 123.5,59.29 U$5.17 123.42,53.02 124.77,51.67 124.77,48.82 121.76,45.96 120.96,45.96 119.85,44.85 119.85,42.31 120.64,41.51 v120.64,40.72
  Bottom 0.254: RN2.8 RN3.8 | v120.64,40.72 IC11.4
DIO3  (via drill 0.6)
  Top 0.254: RN2.7 123.19,76.76 122.55,77.71 122.55,82.31 P2.3 126.26,89.04 CN4.3 | RN3.7 123.19,66.83 122.23,65.96 122.23,60.56 120.96,59.29 U$5.16 120.88,50.96 v119.38,49.45 | v116.36,47.55 115.56,45.96 115.17,45.56 115.17,41.99 IC11.5
  Bottom 0.254: RN2.7 RN3.7 | v119.38,49.45 117.47,47.55 v116.36,47.55
DIO4
  Top 0.254: RN2.6 121.91,75.8 121.91,77.39 120.01,79.3 120.01,82.31 P2.4 122.3,87.61 CN4.4 | RN3.6 120.64,66.83 119.69,65.96 119.69,60.56 118.42,59.29 U$5.15 118.42,48.34 116.2,46.12 IC11.6
  Bottom 0.254: RN2.6 RN3.6
DIO5
  Top 0.254: RN3.5 118.1,67.07 116.83,65.88 116.83,60.25 115.88,59.29 U$5.14 115.88,50.88 113.66,48.66 IC11.7
  Bottom 0.254: RN3.5 RN2.5 118.1,76.91 118.74,77.55 125.41,77.55 126.36,78.34 126.36,80.88 P2.A 127.95,82.47 127.95,84.69 129.85,87.23 131.76,87.23 134.18,89.66 CN4.A
DIO6
  Top 0.254: RN3.4 115.56,66.83 114.61,65.96 114.61,60.56 113.34,59.29 U$5.13 113.34,49.13 112.39,48.18 112.39,44.29 IC11.8
  Bottom 0.254: RN3.4 RN2.4 115.56,75.33 118.42,78.03 118.58,78.03 123.34,78.03 123.82,78.34 123.82,80.88 P2.B 125.09,82.15 125.09,84.38 126.36,85.65 126.99,85.65 130.22,89.51 CN4.B
DIO7
  Top 0.254: RN3.3 113.02,66.83 112.07,65.96 112.07,60.56 110.8,59.29 U$5.12 110.72,53.66 111.12,53.26 IC11.9
  Bottom 0.254: RN3.3 112.95,73.42 RN2.3 118.26,78.5 120.49,78.5 121.28,78.98 121.28,80.88 P2.C 122.55,82.15 122.55,84.69 126.26,89.04 CN4.C
DIO8  (via drill 0.6)
  Top 0.254: RN3.2 110.48,66.83 109.53,65.96 109.53,60.56 108.26,59.29 U$5.11 108.26,55.17 107.94,54.85 107.94,51.83 107.31,51.2 v107.31,41.51
  Bottom 0.254: RN3.2 RN2.2 110.48,74.22 111.75,75.49 114.3,75.49 118.74,79.61 118.74,80.88 P2.D 120.01,82.15 120.01,84.69 122.3,87.61 CN4.D | v107.31,41.51 109.61,41.51 IC11.10
DO1  (via drill 0.6)
  Top 0.254: U$5.2 128.5,60.17 127.31,58.98 v127.31,52.78 | v110.33,52.94 110.33,52.63 110.48,52.31 110.48,47.86 110.01,47.39 v110.01,47.23
  Bottom 0.254: v127.31,52.78 119.06,52.78 118.42,52.15 115.56,52.15 114.93,52.78 110.48,52.78 v110.33,52.94 | v110.01,47.23 109.53,47.23 108.58,46.91 IC11.11
DO2  (via drill 0.6)
  Top 0.254: U$5.3 125.96,60.48 124.77,59.29 v124.77,54.53 | v108.9,54.53 108.9,51.99 108.58,51.67 108.58,47.39 109.85,46.12 109.85,44.29 IC11.12
  Bottom 0.254: v124.77,54.53 v108.9,54.53
DO3  (via drill 0.6)
  Top 0.254: U$5.4 123.5,60.56 122.23,59.29 v122.23,58.34 | v106.99,55.01 106.99,51.83 106.04,50.88 IC11.13
  Bottom 0.254: v122.23,58.34 107.15,58.34 v106.99,55.01
DO4  (via drill 0.6)
  Top 0.254: U$5.5 120.96,60.56 119.69,59.29 119.69,51.04 v119.38,50.72 | v104.77,48.5 104.77,44.29 IC11.14
  Bottom 0.254: v119.38,50.72 119.06,50.72 117.15,48.82 104.77,48.82 v104.77,48.5
DO5  (via drill 0.6)
  Top 0.254: U$5.6 118.42,60.56 117.47,59.29 117.47,55.01 117.63,54.53 117.63,51.99 117.15,51.51 v117.15,50.4 | v103.5,49.13 IC11.15